# Altium schematic sheet hwmon_2.SchDoc: Hardware Monitoring
size A3; Date: DO NOT USE, RATHER USE PROJ OPTIONS; DrawnBy: DO NOT USE, RATHER USE PROJ OPTIONS; Engineer: DO NOT USE, RATHER USE PROJ OPTIONS; Organization: DO NOT USE, RATHER USE PROJ OPTIONS; DocumentNumber: DO NOT USE, RATHER USE PROJ OPTIONS; Revision: DO NOT USE, RATHER USE PROJ OPTIONS; SheetNumber: 28; SheetTotal: 29; SCH_Sheet_Filename: hwmon_2.SchDoc; CurrentTime: DO NOT USE, RATHER USE PROJ OPTIONS; Time: DO NOT USE, RATHER USE PROJ OPTIONS; DocumentFullPathAndName: DO NOT USE, RATHER USE PROJ OPTIONS; DocumentName: DO NOT USE, RATHER USE PROJ OPTIONS; ModifiedDate: DO NOT USE, RATHER USE PROJ OPTIONS; ImagePath: DO NOT USE, RATHER USE PROJ OPTIONS
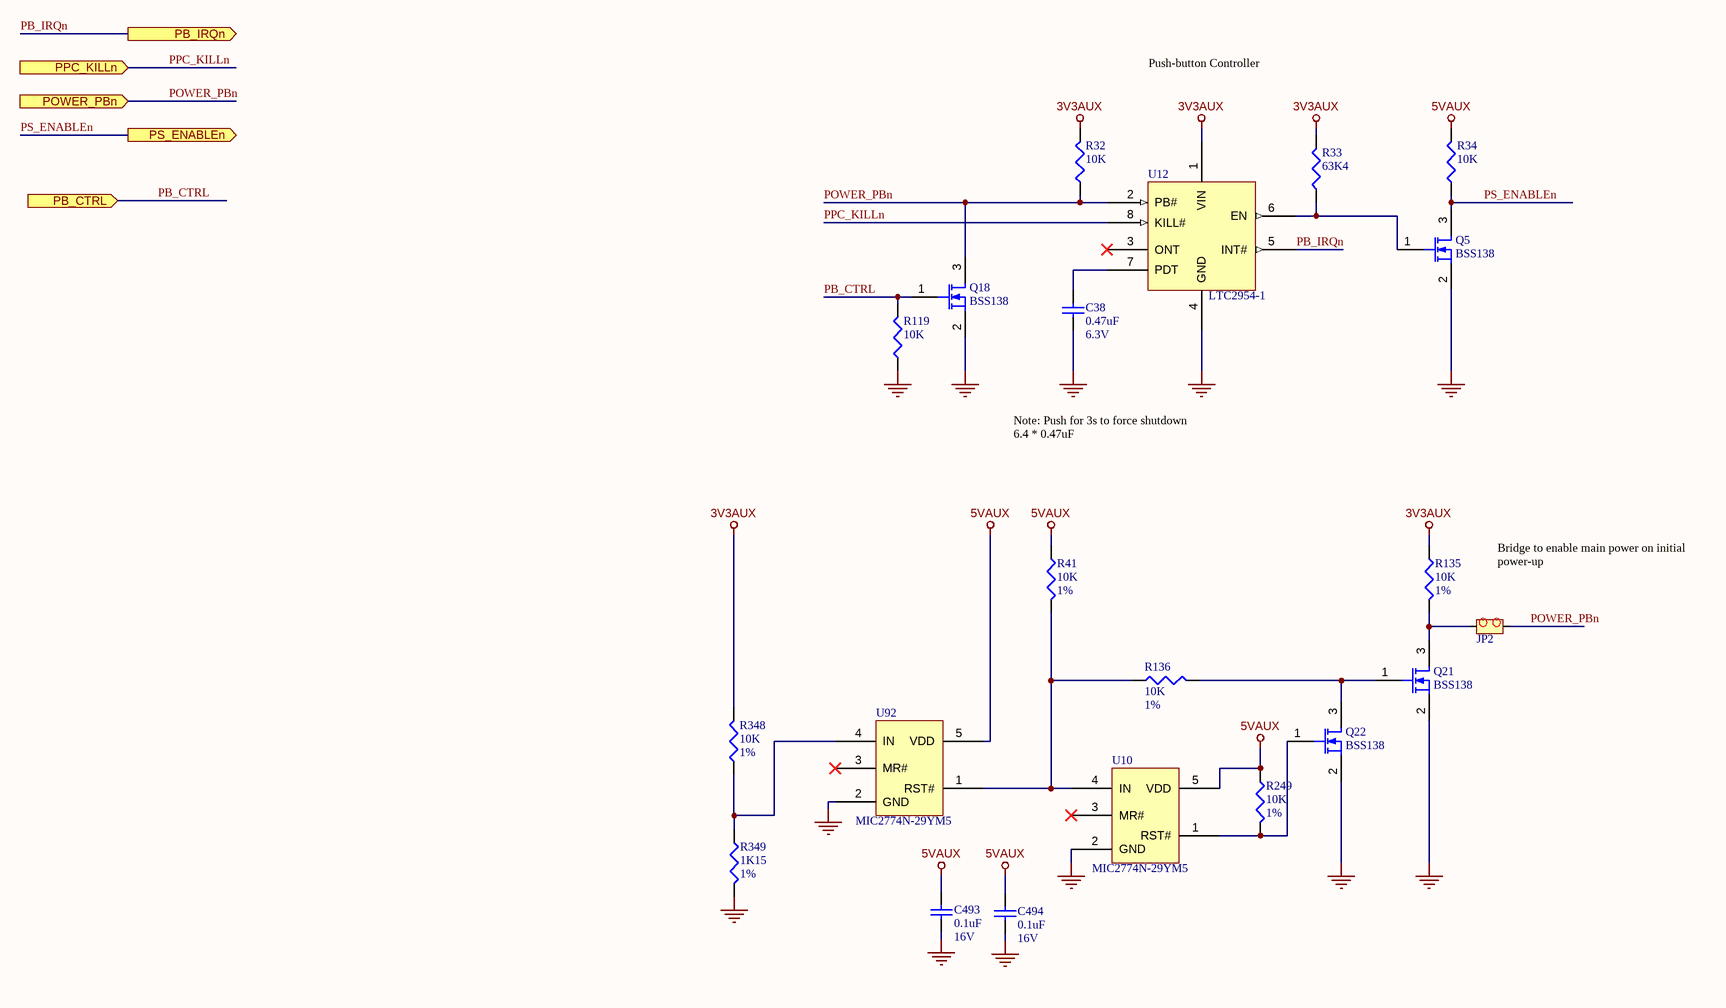
[diagram p0: hwmon_2.SchDoc]

## Parts
C38  value 0.47uF  Rating: 6.3V  [CAPC1005X55L]  (hidden comment: CapStd)
C493  Rating: 16V  [CAPC1005X60L]  (hidden comment: 0.1uF)
C494  Rating: 16V  [CAPC1005X60L]  (hidden comment: 0.1uF)
JP2  0022032021  [MOLEX_0022032021]  (value not drawn)
Q5  BSS138  [SOT95P245X110-3N]
Q18  BSS138  [SOT95P245X110-3N]
Q21  BSS138  [SOT95P245X110-3N]
Q22  BSS138  [SOT95P245X110-3N]
R32  10K  [RESC1005X40L]
R33  63K4  [RESC1005X40L]
R34  10K  [RESC1005X40L]
R41  Tolerance: 1%  [RESC1005X40L]  (hidden comment: 10K)
R119  10K  [RESC1005X40L]
R135  Tolerance: 1%  [RESC1005X40L]  (hidden comment: 10K)
R136  Tolerance: 1%  [RESC1005X40L]  (hidden comment: 10K)
R249  Tolerance: 1%  [RESC1005X40L]  (hidden comment: 10K)
R348  Tolerance: 1%  [RESC1005X40L]  (hidden comment: 10K)
R349  Tolerance: 1%  [RESC1005X40L]  (hidden comment: 1K15)
U10  MIC2774N-29YM5  [SOT23-5]
U12  LTC2954-1  [TSOT-23-8]
U92  MIC2774N-29YM5  [SOT23-5]

## Ports
PB_CTRL (in), PB_IRQn (out), POWER_PBn (in), PPC_KILLn (in), PS_ENABLEn (out)

## Nets
3V3AUX: R32.2 R33.2 R135.1 R348.2 U12.1(VIN)
5VAUX: C493.2 C494.2 R34.2 R41.1 R249.1 U10.5(VDD) U92.5(VDD)
GND: C38.2 C493.1 C494.1 Q5.2(S) Q18.2(S) Q21.2(S) Q22.2(S) R119.1 R349.2 U10.2(GND) U12.4(GND) U92.2(GND)
PB_CTRL: Q18.1(G) R119.2 ; port PB_CTRL
PB_IRQn: U12.5(INT#) ; port PB_IRQn
POWER_PBn: JP2.2 Q18.3(D) R32.1 U12.2(PB#) ; port POWER_PBn
PPC_KILLn: U12.8(KILL#) ; port PPC_KILLn
PS_ENABLEn: Q5.3(D) R34.1 ; port PS_ENABLEn
NetC38_1: C38.1 U12.7(PDT)
NetJP2_1: JP2.1 Q21.3(D) R135.2
NetQ5_1: Q5.1(G) R33.1 U12.6(EN)
NetQ21_1: Q21.1(G) Q22.3(D) R136.2
NetQ22_1: Q22.1(G) R249.2 U10.1(RST#)
NetR41_2: R41.2 R136.1 U10.4(IN) U92.1(RST#)
NetR348_1: R348.1 R349.1 U92.4(IN)

Not connected (* = marked no-connect by the designer): U10 3(MR#)*; U12 3(ONT)*; U92 3(MR#)*

## Notes on the sheet
- Push-button Controller
- Note: Push for 3s to force shutdown
  6.4 * 0.47uF
- Bridge to enable main power on initial power-up
- 2009   THIS DOCUMENT IS THE PROPERTY OF THE OWNER, AND MAY NOT BE COPIED OR USED FOR ANY PURPOSE OTHER THAN THAT FOR WHICH IT IS SUPPLIED WITHOUT PERMISSION IN WRITING FROM THE OWNER.
- C
- DATESTAMP OF THIS PRINT
- DRAWN BY:
- DOCUMENT NUMBER:
- SCHEMATIC FILENAME:
- PCB FILENAME:
- ENGINEER:
- APPROVED:
- CIRCUIT DIAGRAM
- DATE
- SHEET
- REVISION
- OF

## Library data of the parts
C38 = CAP-CER-7: 0.47uF, Ceramic Capacitor; POD number: CAP-CER-7
C493 C494 = CAP-CER-1: 0.1uF, Ceramic Capacitor; Manufacturer: VENKEL; PartNum: C0402X7R160-104KN; Tolerance: 10%; Dielectric: X7R; POD number: CAP-CER-1; Value: 0.1uF; RoHS: Y; Sort Value: 0.1; Category: Capacitors; Subcategory: Ceramic
JP2 = CONN-PCB-14: 1x2, 2.56mm, Header/Jumper; Manufacturer: Molex; POD number: CONN-PCB-14; PartNum: 0022032021; RoHS: Y; Category: CONN; Subcategory: PCB
Q5 Q18 Q21 Q22 = TRANS-NFET-0: N-Channel Logic Level Enhancement Mode Field Effect Transistor; Manufacturer: Fairchild Semiconductor; Rating: 0.22A; POD number: TRANS-NFET-0; PartNum: BSS138; RoHS: Y; Category: TRANS; Subcategory: NFET
R32 R34 R119 = RES-TF-5: 10K, 1.1mm x 0.5mm, Thick Film Resistor; Manufacturer: ROYALOHM; PartNum: 0402WGJ0103T1E; Tolerance: 5%; Rating: 0.0625W; POD number: RES-TF-5; Value: 10K; Sort Value: 10000; Category: Resistors; Subcategory: ThickFilm; HelpURL: *.pdf
R33 = RES-TF-33: 63K4, 1.1mm x 0.5mm, Thick Film Resistor; Manufacturer: ROYALOHM; PartNum: 0402WGF6342T1E; Tolerance: 1%; Rating: 0.0625W; POD number: RES-TF-33; Value: 63K4; Sort Value: 63400; Category: Resistors; Subcategory: ThickFilm; HelpURL: *.pdf
R41 R135 R136 R249 R348 = RES-TF-20: 10K, 1.1mm x 0.5mm, Thick Film Resistor; Manufacturer: ROYALOHM; PartNum: 0402WGF0103T1E; Rating: 0.0625W; POD number: RES-TF-20; Value: 10K; Sort Value: 10000; Category: Resistors; Subcategory: ThickFilm; HelpURL: http://www.royalohm.com/pdf/general.pdf
R349 = RES-TF-28: 1K15, 1.1mm x 0.5mm, Thick Film Resistor; Manufacturer: ROYALOHM; PartNum: 0402WGF1150T1E; Rating: 0.0625W; POD number: RES-TF-28; Value: 1K15; Sort Value: 1150; Category: Resistors; Subcategory: ThickFilm; HelpURL: *.pdf
U10 U92 = IC-MON-4: Dual-power low voltage supervisor; Manufacturer: Micrel; POD number: IC-MON-4; PartNum: MIC2774N-29YM5; RoHS: Y; Category: IC; Subcategory: Monitoring
U12 = IC-MON-8: Push Button On/Off Controller; POD number: IC-MON-8